# Altium schematic sheet Unrouted.SchDoc
size A3; SheetNumber: 2; SheetTotal: 2
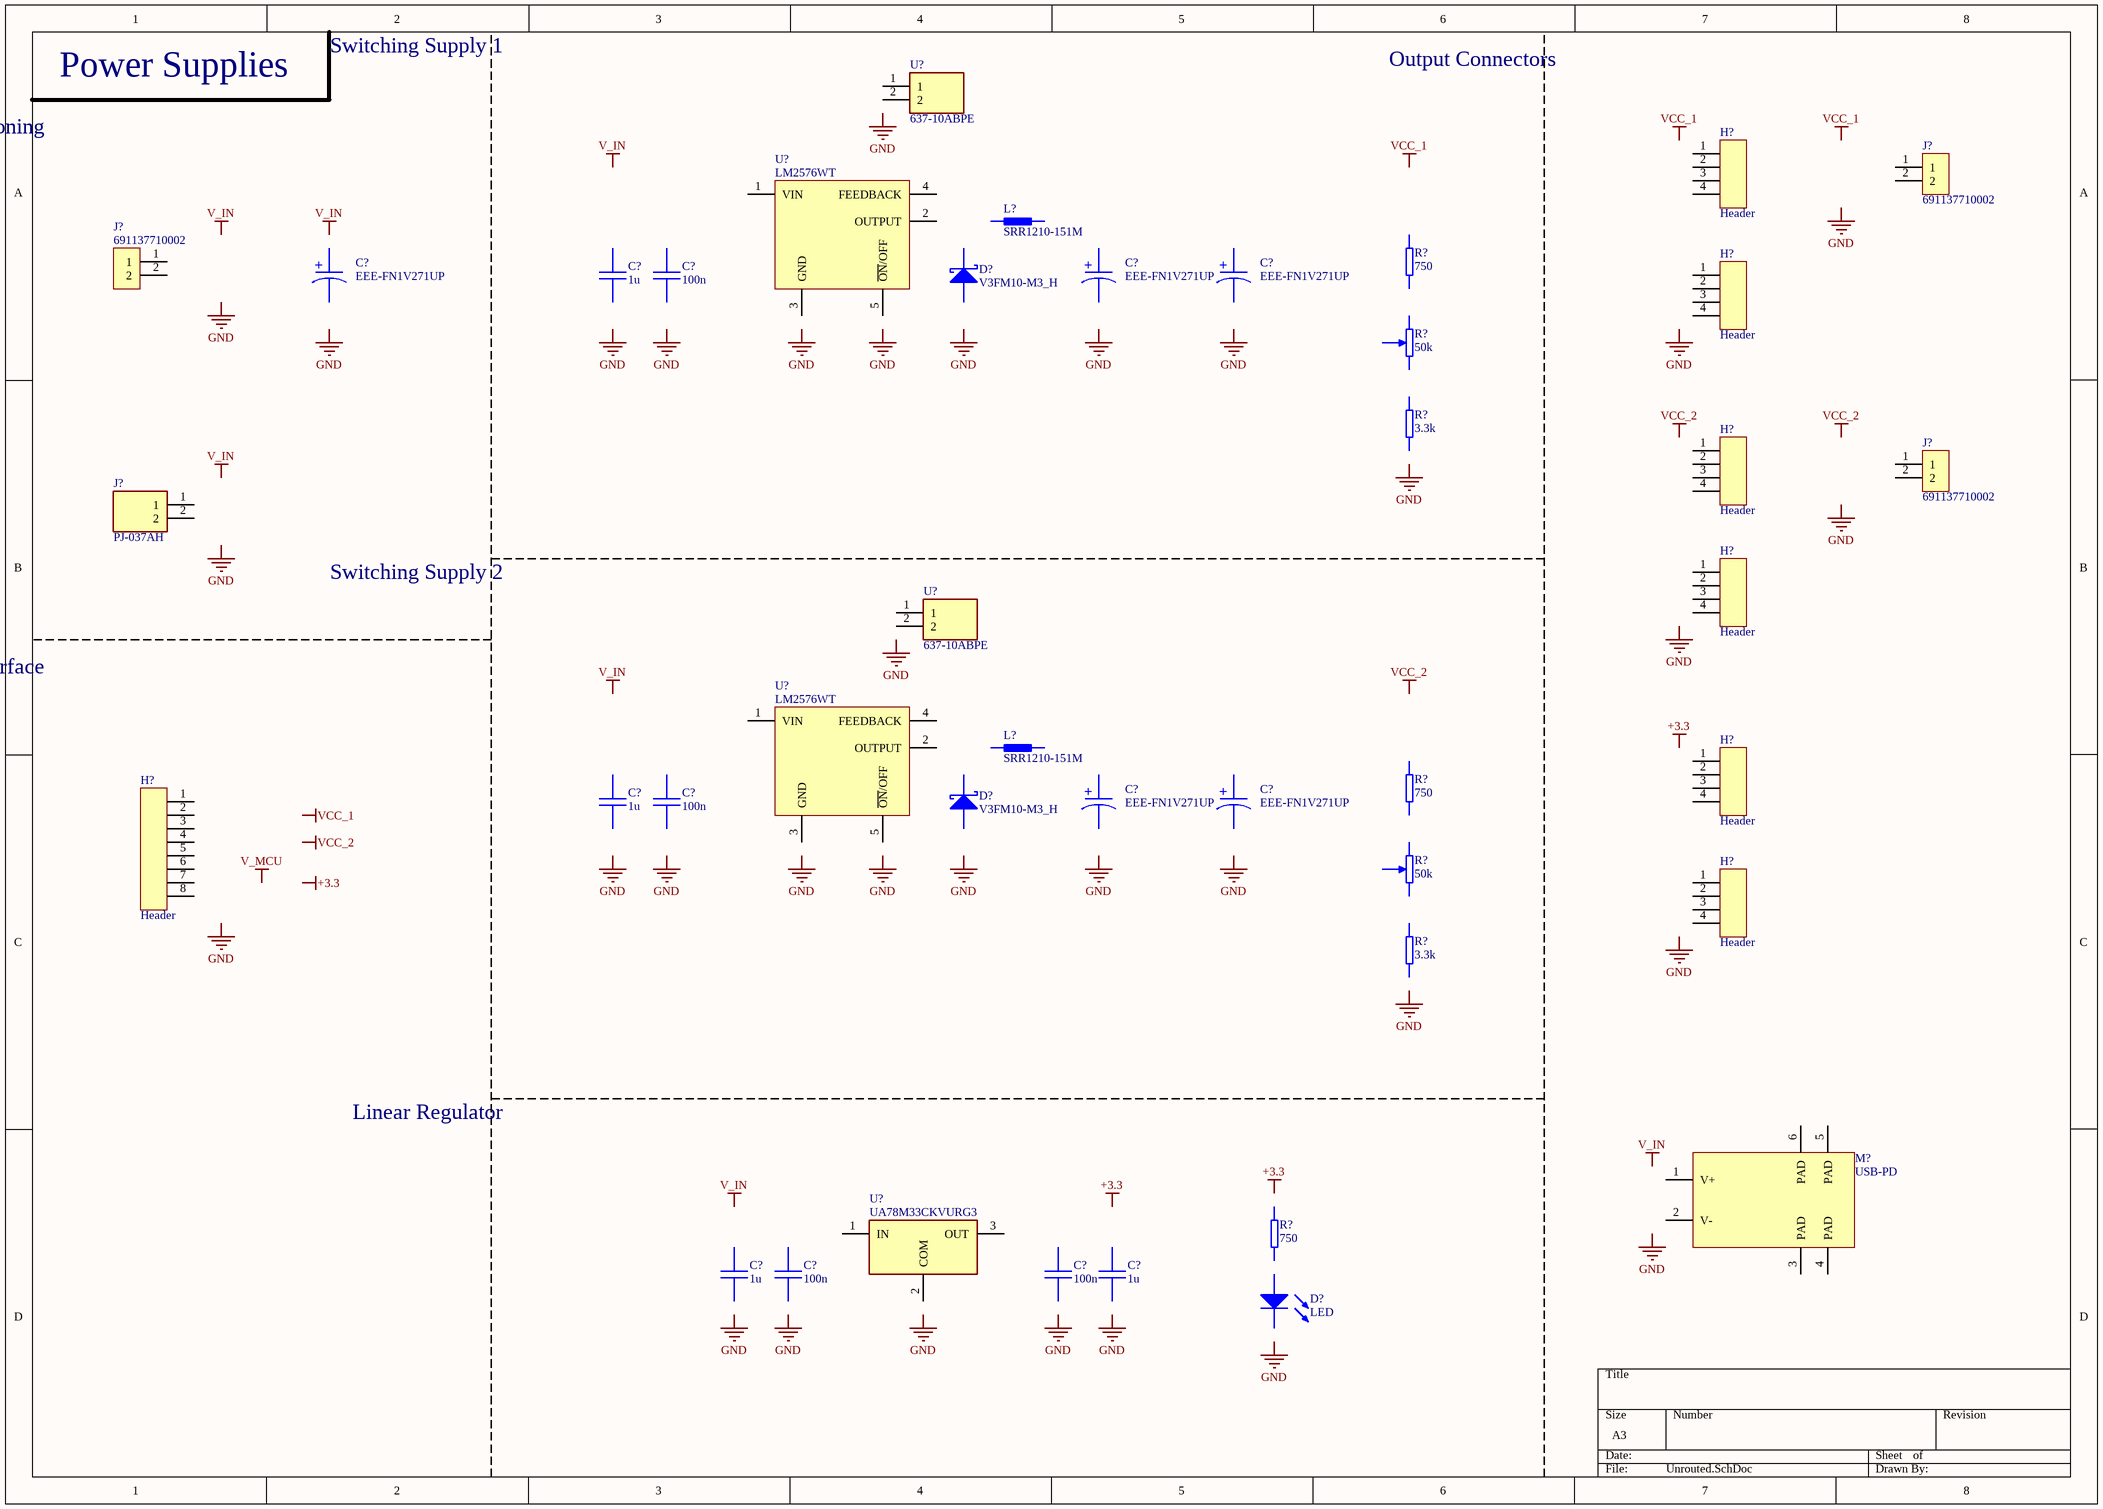
[diagram p0: Unrouted.SchDoc]

## Parts
(Parts that share a designator on the sheet are numbered #1, #2 ... from top to bottom, then left to right.)
C?#1  EEE-FN1V271UP  [EEHZT1E331UP]
C?#2  1u  [CAP0805]
C?#3  100n  [CAP0805]
C?#4  EEE-FN1V271UP  [EEHZT1E331UP]
C?#5  EEE-FN1V271UP  [EEHZT1E331UP]
C?#6  1u  [CAP0805]
C?#7  100n  [CAP0805]
C?#8  EEE-FN1V271UP  [EEHZT1E331UP]
C?#9  EEE-FN1V271UP  [EEHZT1E331UP]
C?#10  1u  [CAP0805]
C?#11  100n  [CAP0805]
C?#12  100n  [CAP0805]
C?#13  1u  [CAP0805]
D?#1  V3FM10-M3_H  [DO-219AB]
D?#2  V3FM10-M3_H  [DO-219AB]
D?#3  LED  [LEDM2012X80N]
H?#1  Header  [Header_1X4]
H?#2  Header  [Header_1X4]
H?#3  Header  [Header_1X4]
H?#4  Header  [Header_1X4]
H?#5  Header  [Header_1X4]
H?#6  Header  [Header_1X8]
H?#7  Header  [Header_1X4]
J?#1  691137710002  [SHDR2W70P0X500_1X2_1000X750X1160P]
J?#2  691137710002  [SHDR2W70P0X500_1X2_1000X750X1160P]
J?#3  691137710002  [SHDR2W70P0X500_1X2_1000X750X1160P]
J?#4  PJ-037AH  [PJ037AH]
L?#1  SRR1210-151M  [INDPM120120X1000N-D]
L?#2  SRR1210-151M  [INDPM120120X1000N-D]
M?  USB-PD  [USB_C-PD]
R?#1  750  [RESC0805]
R?#2  50k  [3339P1103LF]
R?#3  3.3k  [RESC0805]
R?#4  750  [RESC0805]
R?#5  50k  [3339P1103LF]
R?#6  3.3k  [RESC0805]
R?#7  750  [RESC0805]
U?#1  637-10ABPE  [63710ABPE]
U?#2  LM2576WT  [TO-220-5]
U?#3  637-10ABPE  [63710ABPE]
U?#4  LM2576WT  [TO-220-5]
U?#5  UA78M33CKVURG3  [TO-252-3]

## Nets

Not connected (* = marked no-connect by the designer): C?#1 1 2; C?#2 1 2; C?#3 1 2; C?#4 1 2; C?#5 1 2; C?#6 1 2; C?#7 1 2; C?#8 1 2; C?#9 1 2; C?#10 1 2; C?#11 1 2; C?#12 1 2; C?#13 1 2; D?#1 1(K) 2(A); D?#2 1(K) 2(A); D?#3 1(K) 2(A); H?#1 1 2 3 4; H?#2 1 2 3 4; H?#3 1 2 3 4; H?#4 1 2 3 4; H?#5 1 2 3 4; H?#6 1 2 3 4 5 6 7 8; H?#7 1 2 3 4; J?#1 1 2; J?#2 1 2; J?#3 1 2; J?#4 1 2; L?#1 1 2; L?#2 1 2; M? 1(V+) 2(V-) 3(PAD) 4(PAD) 5(PAD) 6(PAD); R?#1 1 2; R?#2 1 2 3; R?#3 1 2; R?#4 1 2; R?#5 1 2 3; R?#6 1 2; R?#7 1 2; U?#1 1 2; U?#2 1(VIN) 2(OUTPUT) 3(GND) 4(FEEDBACK) 5(~{ON}/OFF); U?#3 1 2; U?#4 1(VIN) 2(OUTPUT) 3(GND) 4(FEEDBACK) 5(~{ON}/OFF); U?#5 1(IN) 2(COM) 3(OUT)

## Notes on the sheet
- Power Supplies
- Switching Supply 1
- Output Connectors
- Input Connectors and Conditioning
- Switching Supply 2
- Power Interface
- Linear Regulator
- Labels drawn without touching a wire or pin: +3.3, GND, V_IN, V_MCU, VCC_1, VCC_2
- (in symbol EEE-FN1V271UP) +

## Library data of the parts
C?#1 C?#4 C?#5 C?#8 C?#9 = EEE-FN1V271UP: Capacitor Polarised; Manufacturer_Name: Panasonic; Datasheet Link: http://industrial.panasonic.com/cdbs/www-data/pdf/RDE0000/RDE0000C1259.pdf; Height: 10.8mm; Manufacturer_Part_Number: EEE-FN1V271UP; Mouser Part Number: 667-EEE-FN1V271UP; Mouser Price/Stock: https://www.mouser.co.uk/ProductDetail/Panasonic/EEE-FN1V271UP/?qs=OlC7AqGiEDkrGQxqM1X3hg%3D%3D; Arrow Part Number: EEE-FN1V271UP; Arrow Price/Stock: https://www.arrow.com/en/products/eee-fn1v271up/panasonic
C?#2 C?#3 C?#6 C?#7 C?#10-C?#13 = Capacitor - Non Polarized: Non Polarized Capacitor
D?#1 D?#2 = V3FM10-M3_H: Schottky Diode; Manufacturer_Name: Vishay; Manufacturer_Part_Number: V3FM10-M3/H; Datasheet Link: https://mouser.componentsearchengine.com/Datasheets/1/V3FM10-M3_H.pdf; Height: 1.08mm; Mouser Part Number: 78-V3FM10-M3/H; Mouser Price/Stock: https://www.mouser.co.uk/ProductDetail/Vishay-General-Semiconductor/V3FM10-M3-H?qs=F5EMLAvA7IChj%2FkhLK3e0A%3D%3D; Arrow Part Number: V3FM10-M3/H; Arrow Price/Stock: https://www.arrow.com/en/products/v3fm10-m3h/vishay
D?#3 = LED: General Purpose LED; ComponentLink1Description: Datasheet; ComponentLink1URL: https://www.smc-diodes.com/propdf/1N4148W%20N0571%20REV.E.pdf
H?#1-H?#5 H?#7 = 4-Pin Header
H?#6 = 8-Pin Header: System: Connector
J?#1-J?#3 = 691137710002: Connector; Manufacturer_Name: Wurth Elektronik; Datasheet Link: https://katalog.we-online.com/em/datasheet/691137710002.pdf; Height: 11.6mm; Manufacturer_Part_Number: 691137710002; Mouser Part Number: 710-691137710002; Mouser Price/Stock: https://www.mouser.co.uk/ProductDetail/Wurth-Elektronik/691137710002?qs=lBTPRtX1sU9LnHBbviNKGA%3D%3D
J?#4 = PJ-037AH: Connector; Manufacturer_Name: Same Sky; Datasheet Link: https://www.arrow.com/en/products/pj-037ah/cui-devices; Height: 11.2mm; Manufacturer_Part_Number: PJ-037AH; Mouser Part Number: 490-PJ-037AH; Mouser Price/Stock: https://www.mouser.co.uk/ProductDetail/CUI-Devices/PJ-037AH?qs=WyjlAZoYn50M7m1AkzfPaQ%3D%3D; Arrow Part Number: PJ-037AH; Arrow Price/Stock: https://www.arrow.com/en/products/pj-037ah/cui-devices?region=nac
L?#1 L?#2 = SRR1210-151M: Inductor; Manufacturer_Name: Bourns; Datasheet Link: https://www.bourns.com/docs/Product-Datasheets/SRR1210.pdf; Height: 10mm; Manufacturer_Part_Number: SRR1210-151M; Mouser Part Number: 652-SRR1210-151M; Mouser Price/Stock: https://www.mouser.co.uk/ProductDetail/Bourns/SRR1210-151M?qs=4vvWAaIu%2Fq7S1x5W5meWRQ%3D%3D; Arrow Part Number: SRR1210-151M; Arrow Price/Stock: https://www.arrow.com/en/products/srr1210-151m/bourns?region=nac
R?#1 R?#3 R?#4 R?#6 R?#7 = Resistor
R?#2 R?#5 = Potentiometer: Potentionmeter
U?#1 U?#3 = 637-10ABPE: Undefined or Miscellaneous; Manufacturer_Name: Wakefield Thermal; Datasheet Link: https://media.digikey.com/pdf/Data%20Sheets/Wakefield%20Thermal%20PDFs/634%20Heat%20Sinks.pdf; Height: 25.4mm; Manufacturer_Part_Number: 637-10ABPE; Mouser Part Number: 567-637-10ABPE; Mouser Price/Stock: https://www.mouser.co.uk/ProductDetail/Wakefield-Vette/637-10ABPE?qs=1%252ByrAFyf4wFy1bU0h8s7wA%3D%3D
U?#2 U?#4 = LM2576WT: Integrated Circuit; Manufacturer_Name: Microchip; Manufacturer_Part_Number: LM2576WU-TR; Datasheet Link: http://ww1.microchip.com/downloads/en/DeviceDoc/lm2576.pdf; Mouser Part Number: 998-LM2576WT; Mouser Price/Stock: https://www.mouser.co.uk/ProductDetail/Microchip-Technology/LM2576-5.0WU-TR?qs=Y3Q3JoKAO1SBuj%2FVzZkeQA%3D%3D; Arrow Part Number: LM2576-5.0WU-TR; Arrow Price/Stock: https://www.arrow.com/en/products/lm2576-5.0wu-tr/microchip-technology?region=nac
U?#5 = UA78M33CKVURG3: Linear Voltage Regulator; Manufacturer_Name: Texas Instruments; Datasheet Link: https://www.ti.com/lit/gpn/ua78m?HQS=ti-null-null-sf-df-pf-sep-wwe&DCM=yes; Height: 2.52mm; Manufacturer_Part_Number: UA78M33CKVURG3; Mouser Part Number: 595-UA78M33CKVURG3; Mouser Price/Stock: https://www.mouser.co.uk/ProductDetail/Texas-Instruments/UA78M33CKVURG3?qs=0O%2FZFlpUpJXrDg4gfD1Q2g%3D%3D; Arrow Part Number: UA78M33CKVURG3; Arrow Price/Stock: https://www.arrow.com/en/products/ua78m33ckvurg3/texas-instruments?region=nac